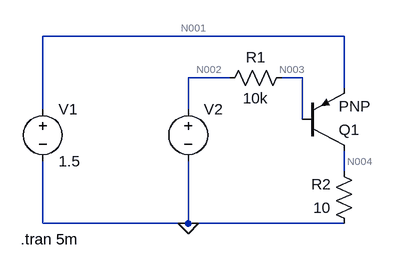
[diagram p0: schematic Draft2.asc]
Draft2.asc, the LTspice schematic file:
Version 4
SHEET 1 880 680
WIRE 448 16 -16 16
WIRE 272 80 208 80
WIRE 384 80 352 80
WIRE 448 96 448 16
WIRE -16 128 -16 16
WIRE 208 128 208 80
WIRE 384 144 384 80
WIRE 448 224 448 192
WIRE -16 304 -16 208
WIRE 208 304 208 208
WIRE 208 304 -16 304
WIRE 448 304 208 304
FLAG 208 304 0
SYMBOL voltage -16 112 R0
WINDOW 123 0 0 Left 0
WINDOW 39 0 0 Left 0
SYMATTR InstName V1
SYMATTR Value 1.5
SYMBOL voltage 208 112 R0
WINDOW 3 24 96 Invisible 2
WINDOW 123 0 0 Left 0
WINDOW 39 0 0 Left 0
SYMATTR InstName V2
SYMATTR Value PULSE(0 2 0 1p 1p 0.5m 1m)
SYMBOL res 368 64 R90
WINDOW 0 0 56 VBottom 2
WINDOW 3 32 56 VTop 2
SYMATTR InstName R1
SYMATTR Value 10k
SYMBOL res 464 320 R180
WINDOW 0 36 76 Left 2
WINDOW 3 36 40 Left 2
SYMATTR InstName R2
SYMATTR Value 10
SYMBOL pnp 384 192 M180
SYMATTR InstName Q1
TEXT -50 328 Left 2 !.tran 5m

The netlist it stands for:
* Draft2.asc
V1 N001 0 1.5
V2 N002 0 PULSE(0 2 0 1p 1p 0.5m 1m)
R1 N003 N002 10k
R2 0 N004 10
Q1 N004 N003 N001 0 PNP
.model NPN NPN
.model PNP PNP
.lib standard.bjt
.tran 5m
.backanno
.end

* Results of the author's LTspice run, read from the files saved beside the schematic
* Operating Point, zero values left out:
*   V(n001) = 1.5 V
*   V(n003) = 676.3 mV
*   V(n004) = 67.63 mV
*   Ic(Q1) = -6.763 mA
*   Ib(Q1) = -67.63 µA
*   Ie(Q1) = 6.831 mA
*   I(R2) = -6.763 mA
*   I(R1) = 67.63 µA
*   I(V2) = 67.63 µA
*   I(V1) = -6.831 mA
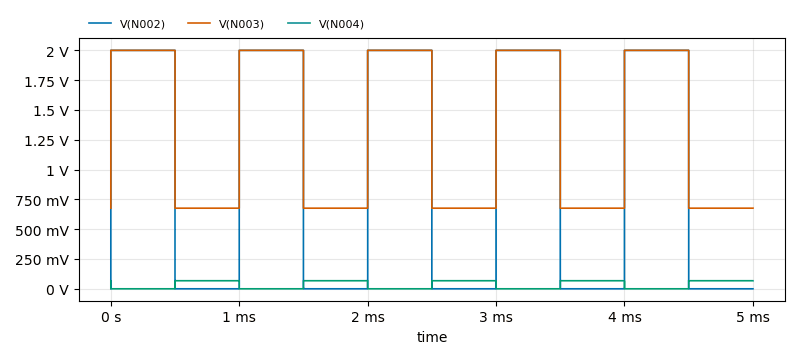
[diagram p1: Transient Analysis of Draft2.asc, plotted from the saved traces]
* Transient Analysis, 1 run:
*   V(N002): min 0 V, max 2 V, average 1 V, rms 1.414 V, last 0 V
*   V(N003): min 676.2 mV, max 2 V, average 1.338 V, rms 1.493 V, last 676.3 mV
*   V(N004): min 0 V, max 67.63 mV, average 33.81 mV, rms 47.82 mV, last 67.63 mV